# Altium schematic sheet 300_12_DCDC.SchDoc
size A4; SheetNumber: 3; SheetTotal: 7
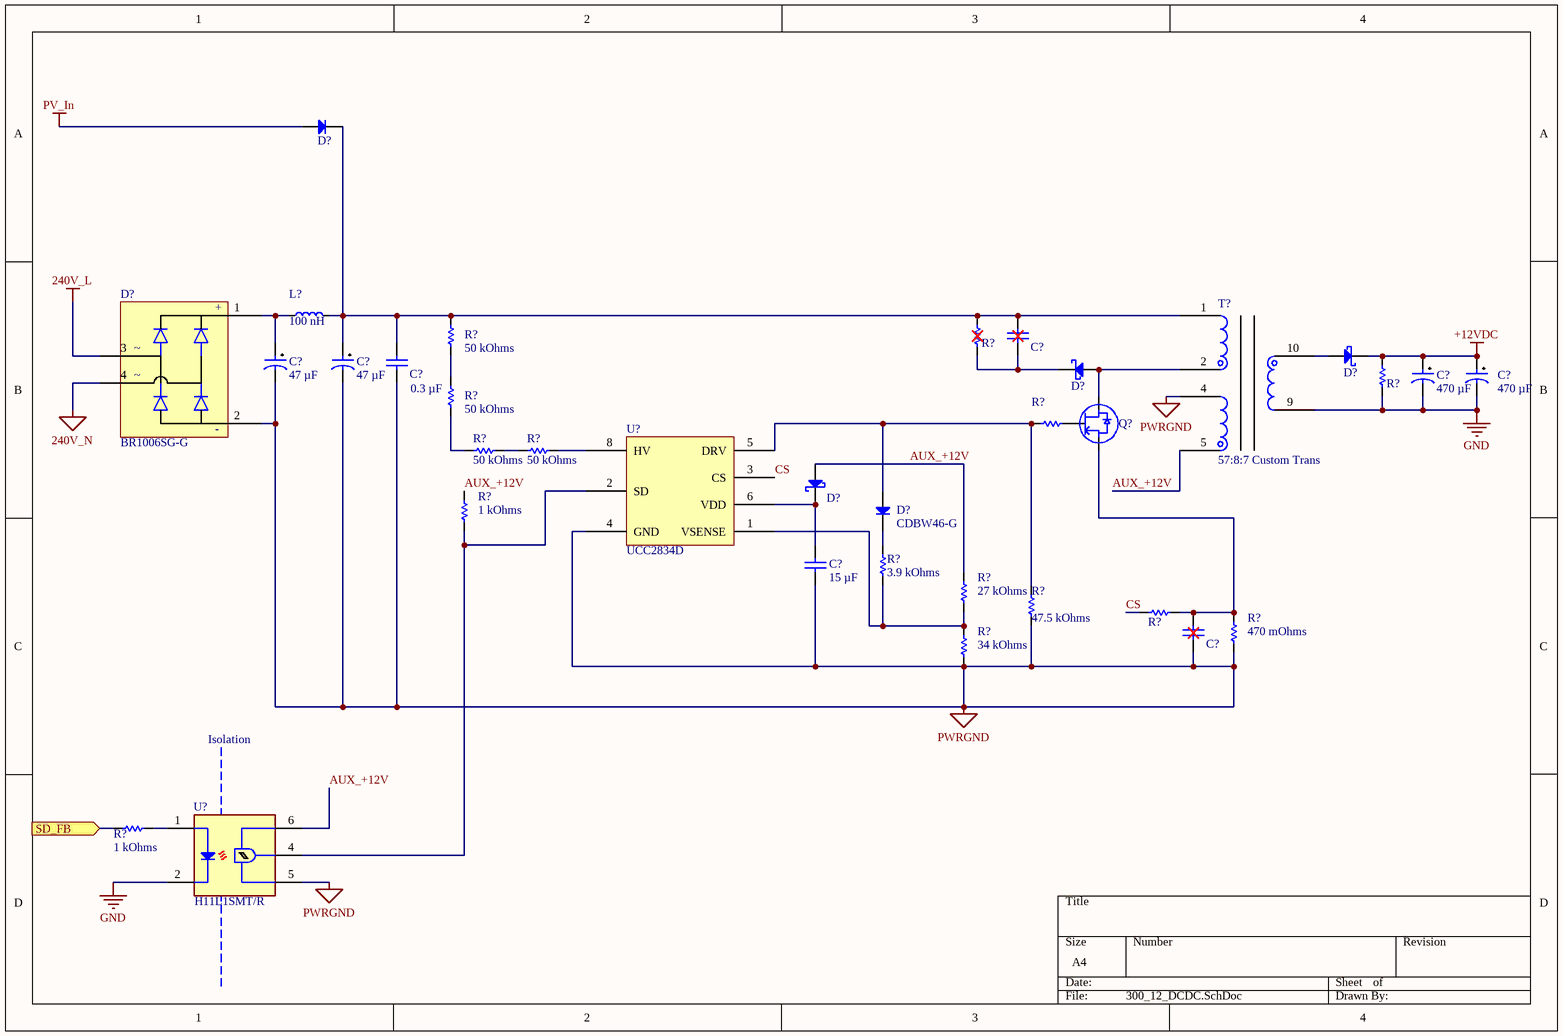
[diagram p0: 300_12_DCDC.SchDoc]

## Parts
(Parts that share a designator on the sheet are numbered #1, #2 ... from top to bottom, then left to right.)
C?#1  .1u  [0402c]  (value not drawn)
C?#2  47 µF  [1206C]
C?#3  47 µF  [1206C]
C?#4  0.3 µF  [ECW-F4304JL]
C?#5  470 µF  [A750MS477M1EAAE015]
C?#6  470 µF  [A750MS477M1EAAE015]
C?#7  15 µF  [0805c]
C?#8  .1u  [0402c]  (value not drawn)
D?#1  S3G-13-F  [SMC DO-214AB]  (value not drawn)
D?#2  STPS20M100SG-TR  [D2PAK]  (value not drawn)
D?#3  BR1006SG-G  [BR1006SG-G]
D?#4  UFS180JE3/TR13  [DO-214BA]  (value not drawn)
D?#5  ST1300ATR  [SMA]  (value not drawn)
D?#6  CDBW46-G  [CDBW46-G]
L?  100 nH  [INDP125125X60N]
Q?  STF13NM60ND  [TO-220FP]  (value not drawn)
R?#1  50 kOhms  [1206R]
R?#2  1 kOhms  [0603R]  (value not drawn)
R?#3  9.53 kOhms  [0402R]  (value not drawn)
R?#4  50 kOhms  [1206R]
R?#5  0  [0603R]  (value not drawn)
R?#6  50 kOhms  [1206R]
R?#7  50 kOhms  [1206R]
R?#8  1 kOhms  [0603R]
R?#9  3.9 kOhms  [0603R]
R?#10  27 kOhms  [1206R]
R?#11  0  [0603R]  (value not drawn)
R?#12  47.5 kOhms  [0402R]
R?#13  470 mOhms  [PAC100004707FA1000]
R?#14  34 kOhms  [CMF5034K000FHEB]
R?#15  1 kOhms  [0603R]
T?  57:8:7 Custom Trans  [E25-13-7]
U?#1  UCC2834D
U?#2  H11L1SMT/R  [H11L1SMT/R]

## Ports
SD_FB (in)

## Nets
240V_L: D?#3.3
240V_N: D?#3.4
+12VDC: C?#5.1 C?#6.1 D?#2.1(K) R?#3.2
GND: C?#5.2 C?#6.2 R?#3.1 T?.9 U?#2.2
PV_In: D?#1.2(A)
PWRGND: C?#2.2 C?#3.2 C?#4.2 C?#7.2 C?#8.2 D?#3.2 R?#12.1 R?#13.1 R?#14.1 T?.4 U?#1.4(GND) U?#2.5
AUX_+12V: D?#5.2(A) R?#8.2 R?#10.2 T?.5 U?#2.6
CS: R?#11.1 U?#1.3(CS)
SD_FB: R?#15.1 ; port SD_FB
NetC?#1_1: C?#1.1 C?#3.1 C?#4.1 D?#1.1(K) L?.2 R?#1.2 R?#2.2 T?.1
NetC?#1_2: C?#1.2 D?#4.1(K) R?#2.1
NetC?#2_1: C?#2.1 D?#3.1 L?.1
NetC?#7_1: C?#7.1 D?#5.1(K) U?#1.6(VDD)
NetC?#8_1: C?#8.1 Q?.3(Source) R?#11.2 R?#13.2
NetD?#2_2: D?#2.2(A) T?.10
NetD?#4_2: D?#4.2(A) Q?.2(Drain) T?.2
NetD?#6_1: D?#6.1(K) R?#9.1
NetD?#6_2: D?#6.2(A) R?#5.1 R?#12.2 U?#1.5(DRV)
NetQ?_1: Q?.1(Gate) R?#5.2
NetR?#1_1: R?#1.1 R?#4.2
NetR?#4_1: R?#4.1 R?#6.2
NetR?#6_1: R?#6.1 R?#7.2
NetR?#7_1: R?#7.1 U?#1.8(HV)
NetR?#8_1: R?#8.1 U?#1.2(SD) U?#2.4
NetR?#9_2: R?#9.2 R?#10.1 R?#14.2 U?#1.1(VSENSE)
NetR?#15_2: R?#15.2 U?#2.1

## Notes on the sheet
- Isolation
- (in symbol BR1006SG-G) +; ~; -

## Library data of the parts
C?#1 C?#8 = 1000-0015: CAP CER 0.1UF 16V X7R 0402; Manufacturer: TDK Corporation; Manufacturer Part Number: C1005X7R1C104K050BC; id: 310046; inventory_price: 0.0202; x_Capacitance: 0.1µF; x_Link_Description: Datasheet; x_max_temp: 125°C; x_min_temp: -55°C; x_Tolerance: ±10%; Value: .1u; partnumber: 1000-0015; created_on: 8/04/2019 9:50:39 AM; parttype: Ceramic Capacitors; rohs: 1; updated_on: 24/08/2021 12:09:53 PM; x_Link_URL: https://product.tdk.com/info/en/catalog/datasheets/mlcc_commercial_general_en.pdf?ref_disty=digikey
C?#2 C?#3 = 1033-0002: CAP ALUM 47UF 20% 400V RADIAL; Manufacturer: Panasonic Electronic Components; Manufacturer Part Number: EEU-EE2G470S; id: 459059; inventory_price: 2.43; x_current: Not Applicable; x_Link_Description: Datasheet; x_max_temp: 105°C; x_min_temp: -25°C; x_portToUnleashed: No; partnumber: 1033-0002; created_on: 21/02/2022 8:54:15 PM; parttype: Aluminum Electrolytic Capacitors; rohs: 1; updated_on: 21/02/2022 8:56:13 PM; x_Capacitance: 47 µF; x_inductance: Not Applicable; x_Link_URL: https://industrial.panasonic.com/ww/products/capacitors/aluminum-capacitors/aluminum-cap-lead/models/EEUEE2G470S; x_Power: Not Applicable; x_resistance: Not Applicable; x_temp_coef: Not Applicable; x_Tolerance: ±20%; x_Vol: 400 V
C?#4 = 1094-0005: CAP FILM 0.3UF 5% 400VDC RADIAL; Manufacturer: Panasonic Electronic Components; id: 459053; inventory_price: 1.75; x_current: Not Applicable; x_Link_Description: Datasheet; x_max_temp: 105°C; x_min_temp: -40°C; x_portToUnleashed: No; Manufacturer Part Number: ECW-F4304JL; partnumber: 1094-0005; created_on: 21/02/2022 8:06:52 PM; parttype: Film Capacitors; rohs: 0; updated_on: 21/02/2022 8:08:01 PM; x_Capacitance: 0.3 µF; x_inductance: Not Applicable; x_Link_URL: https://industrial.panasonic.com/ww/products/pt/film-cap-electroequip/models/ECWF4304JL; x_Power: Not Applicable; x_resistance: Not Applicable; x_temp_coef: Not Applicable; x_Tolerance: ±5%; x_Vol: Not Applicable
C?#5 C?#6 = 1032-0004: CAP ALUM POLY 470UF 20% 25V T/H; Manufacturer: KEMET; id: 458848; inventory_price: 1.01; x_current: Not Applicable; x_Link_Description: Datasheet; x_max_temp: 105°C; x_min_temp: -55°C; x_portToUnleashed: No; Manufacturer Part Number: A750MS477M1EAAE015; partnumber: 1032-0004; created_on: 17/02/2022 8:03:33 PM; parttype: Aluminum - Polymer Capacitors; rohs: 1; updated_on: 18/02/2022 8:18:34 AM; x_Capacitance: 470 µF; x_inductance: Not Applicable; x_Link_URL: https://api.kemet.com/component-edge/download/datasheet/A750MS477M1EAAE015.pdf; x_Power: Not Applicable; x_resistance: Not Applicable; x_temp_coef: Not Applicable; x_Tolerance: ±20%; x_Vol: 25 V
C?#7 = 1000-0133: CAP CER 15UF 35V X5R 0805; Manufacturer: TDK Corporation; Manufacturer Part Number: C2012X5R1V156M125AC; id: 458836; inventory_price: 0.68; x_current: Not Applicable; x_max_temp: 85°C; x_min_temp: -55°C; x_portToUnleashed: No; x_Tolerance: ±20%; partnumber: 1000-0133; created_on: 17/02/2022 3:49:01 PM; parttype: Ceramic Capacitors; rohs: 1; updated_on: 17/02/2022 3:49:19 PM; x_Capacitance: 15 µF; x_inductance: Not Applicable; x_Power: Not Applicable; x_resistance: Not Applicable; x_temp_coef: X5R; x_Vol: 35V
D?#1 = 1047-0014: DIODE GEN PURP 400V 3A SMC; Manufacturer: Diodes Incorporated; Current: A; Voltage: V; id: 459057; inventory_price: 0.4; x_Capacitance: Not Applicable; x_Link_Description: Datasheet; x_portToUnleashed: No; Supplier 1: Digi-Key; Supplier Part Number 1: CUS10S30H3FTR-ND; Manufacturer Part Number: S3G-13-F; Mount: SMT; ComponentLink1URL: https://toshiba.semicon-storage.com/info/docget.jsp?did=14077&prodName=CUS10S30; ComponentLink1Description: Datasheet; partnumber: 1047-0014; created_on: 21/02/2022 8:49:25 PM; parttype: Diodes - Rectifiers - Single; rohs: 1; updated_on: 21/02/2022 8:59:25 PM; x_current: Not Applicable; x_inductance: Not Applicable; x_Link_URL: https://www.diodes.com/assets/Datasheets/ds16005.pdf; x_max_temp: N/A; x_min_temp: N/A; x_Power: Not Applicable; x_resistance: Not Applicable; x_temp_coef: Not Applicable; x_Tolerance: Not Applicable; x_Vol: Not Applicable
D?#2 = 1047-0013: DIODE SCHOTTKY 100V 20A D2PAK; Manufacturer: STMicroelectronics; Current: A; Voltage: V; id: 458846; inventory_price: 2.93; x_Capacitance: Not Applicable; x_Link_Description: Datasheet; x_portToUnleashed: No; Supplier 1: Digi-Key; Supplier Part Number 1: CUS10S30H3FTR-ND; Manufacturer Part Number: STPS20M100SG-TR; Mount: SMT; ComponentLink1URL: https://toshiba.semicon-storage.com/info/docget.jsp?did=14077&prodName=CUS10S30; ComponentLink1Description: Datasheet; partnumber: 1047-0013; created_on: 17/02/2022 7:53:41 PM; parttype: Diodes - Rectifiers - Single; rohs: 1; updated_on: 17/02/2022 8:01:32 PM; x_current: Not Applicable; x_inductance: Not Applicable; x_Link_URL: https://www.st.com/content/ccc/resource/technical/document/datasheet/group2/8f/d3/41/ea/82/b2/4b/5a/CD00228904/files/CD00228904.pdf/jcr:content/translations/en.CD00228904.pdf; x_max_temp: N/A; x_min_temp: N/A; x_Power: Not Applicable; x_resistance: Not Applicable; x_temp_coef: Not Applicable; x_Tolerance: Not Applicable; x_Vol: Not Applicable
D?#3 = BR1006SG-G: BRIDGE RECT 1PHASE 600V 10A BR-8
D?#4 = 1047-0010: DIODE GEN PURP 800V 1A DO214BA; Manufacturer: Microchip Technology; Current: A; Voltage: V; id: 458837; inventory_price: 0.86; x_Capacitance: Not Applicable; x_Link_Description: Datasheet; x_portToUnleashed: No; Supplier 1: Digi-Key; Supplier Part Number 1: CUS10S30H3FTR-ND; Manufacturer Part Number: UFS180JE3/TR13; Mount: SMT; ComponentLink1URL: https://toshiba.semicon-storage.com/info/docget.jsp?did=14077&prodName=CUS10S30; ComponentLink1Description: Datasheet; partnumber: 1047-0010; created_on: 17/02/2022 3:56:14 PM; parttype: Diodes - Rectifiers - Single; rohs: 0; updated_on: 18/02/2022 8:01:42 AM; x_current: Not Applicable; x_inductance: Not Applicable; x_Link_URL: https://media.digikey.com/pdf/Data%20Sheets/Microsemi%20PDFs/UFS160J-UFS180J.pdf; x_max_temp: N/A; x_min_temp: N/A; x_Power: Not Applicable; x_resistance: Not Applicable; x_temp_coef: Not Applicable; x_Tolerance: Not Applicable; x_Vol: Not Applicable
D?#5 = 1047-0011: DIODE SCHOTTKY 300V 1A SMA; Manufacturer: SMC Diode Solutions; Current: A; Voltage: V; id: 458838; inventory_price: 0.12135; x_Capacitance: Not Applicable; x_Link_Description: Datasheet; x_portToUnleashed: No; Supplier 1: Digi-Key; Supplier Part Number 1: CUS10S30H3FTR-ND; Manufacturer Part Number: ST1300ATR; Mount: SMT; ComponentLink1URL: https://toshiba.semicon-storage.com/info/docget.jsp?did=14077&prodName=CUS10S30; ComponentLink1Description: Datasheet; partnumber: 1047-0011; created_on: 17/02/2022 3:57:51 PM; parttype: Diodes - Rectifiers - Single; rohs: 1; updated_on: 17/02/2022 6:22:54 PM; x_current: Not Applicable; x_inductance: Not Applicable; x_Link_URL: https://www.smc-diodes.com/propdf/ST1300A%20N1554%20REV.A.pdf; x_max_temp: N/A; x_min_temp: N/A; x_Power: Not Applicable; x_resistance: Not Applicable; x_temp_coef: Not Applicable; x_Tolerance: Not Applicable; x_Vol: Not Applicable
D?#6 = 1047-0012: DIODE SCHOTTKY 100V 150MA SOD123; Manufacturer: Comchip Technology; Current: A; Voltage: V; id: 458839; inventory_price: 0.34; x_Capacitance: Not Applicable; x_Link_Description: Datasheet; x_portToUnleashed: No; Supplier 1: Digi-Key; Supplier Part Number 1: CUS10S30H3FTR-ND; Manufacturer Part Number: CDBW46-G; Mount: SMT; ComponentLink1URL: https://toshiba.semicon-storage.com/info/docget.jsp?did=14077&prodName=CUS10S30; ComponentLink1Description: Datasheet; partnumber: 1047-0012; created_on: 17/02/2022 6:00:01 PM; parttype: Diodes - Rectifiers - Single; rohs: 1; updated_on: 17/02/2022 6:06:35 PM; x_current: Not Applicable; x_inductance: Not Applicable; x_Link_URL: https://www.comchiptech.com/admin/files/product/QW-BA018%20CDBW46-G%20RevD.pdf; x_max_temp: N/A; x_min_temp: N/A; x_Power: Not Applicable; x_resistance: Not Applicable; x_temp_coef: Not Applicable; x_Tolerance: Not Applicable; x_Vol: Not Applicable
L? = 1002-0028: FIXED IND 100NH 2.85A 24MOHM SMD; Manufacturer Part Number: NLCV32T-R10M-EFR; manufacturer: TDK Corporation; id: 459058; inventory_price: 0.1089; x_Capacitance: Not Applicable; x_max_temp: 105°C; x_min_temp: -40°C; x_portToUnleashed: No; x_Tolerance: ±20%; ComponentLink1Description: Datasheet; ComponentLink1URL: https://www.bourns.com/docs/Product-Datasheets/SRR1260.pdf; partnumber: 1002-0028; created_on: 21/02/2022 8:52:59 PM; parttype: Fixed Inductors; rohs: 1; updated_on: 21/02/2022 8:56:58 PM; x_current: 2.85 A; x_inductance: 100 nH; x_Power: Not Applicable; x_resistance: Not Applicable; x_temp_coef: Not Applicable; x_Vol: Not Applicable
Q? = 1051-0004: MOSFET N-CH 600V 11A TO220FP; Manufacturer: STMicroelectronics; Current: A; Voltage: V; id: 458840; inventory_price: 4.14; x_Capacitance: Not Applicable; x_Link_Description: Datasheet; x_max_temp: (TJ); x_min_temp: 150°C; x_portToUnleashed: No; Supplier 1: Digi-Key; Manufacturer Part Number: STF13NM60ND; Supplier Part Number 1: 568-6720-1-ND; Mount: SMT; ComponentLink1Description: Datasheet; partnumber: 1051-0004; created_on: 17/02/2022 6:43:09 PM; parttype: Transistors - FETs, MOSFETs - Single; rohs: 1; updated_on: 17/02/2022 7:23:29 PM; x_current: Not Applicable; x_inductance: Not Applicable; x_Link_URL: https://media.digikey.com/pdf/Data%20Sheets/ST%20Microelectronics%20PDFS/STx13NM60ND_DS.pdf; x_Power: Not Applicable; x_resistance: Not Applicable; x_temp_coef: Not Applicable; x_Tolerance: Not Applicable; x_Vol: Not Applicable
R?#1 R?#4 R?#6 R?#7 = 1007-0164: RES SMD 50K OHM 0.1% 1/4W 1206; Manufacturer: YAGEO; Manufacturer Part Number: RT1206BRD0750KL; id: 458832; inventory_price: 0.65; x_Capacitance: Not Applicable; x_Link_Description: Datasheet; x_max_temp: 155°C; x_min_temp: -55°C; x_portToUnleashed: No; x_Power: 0.25W, 1/4W; x_temp_coef: ±25ppm/°C; partnumber: 1007-0164; created_on: 17/02/2022 3:33:02 PM; parttype: Chip Resistor - Surface Mount; rohs: 1; updated_on: 17/02/2022 3:33:19 PM; x_current: Not Applicable; x_inductance: Not Applicable; x_Link_URL: https://www.yageo.com/upload/media/product/productsearch/datasheet/rchip/PYu-RT_1-to-0.01_RoHS_L_12.pdf; x_resistance: 50 kOhms; x_Tolerance: ±0.1%; x_Vol: Not Applicable
R?#2 R?#8 R?#15 = 1007-0143: RES 1K OHM 0.1% 1/16W 0603; Manufacturer: Stackpole Electronics Inc; Manufacturer Part Number: RNCS0603BKE1K00; id: 436190; inventory_price: 0.2051; x_Link_Description: Datasheet; x_max_temp: 155°C; x_min_temp: -55°C; partnumber: 1007-0143; created_on: 10/08/2021 1:47:46 PM; parttype: Chip Resistor - Surface Mount; rohs: 1; updated_on: 10/08/2021 1:48:00 PM; x_Link_URL: https://www.seielect.com/catalog/sei-rncs_rnch.pdf; x_Power: 1/16W; x_Tolerance: ±0.1%
R?#3 = 1007-0168: RES SMD 9.53K OHM 1% 1/16W 0402; Manufacturer: Vishay Dale; Manufacturer Part Number: CRCW04029K53FKED; id: 458847; inventory_price: 0.1; x_Capacitance: Not Applicable; x_Link_Description: Datasheet; x_max_temp: 155°C; x_min_temp: -55°C; x_portToUnleashed: No; x_Power: 0.063W, 1/16W; x_temp_coef: ±100ppm/°C; partnumber: 1007-0168; created_on: 17/02/2022 8:00:30 PM; parttype: Chip Resistor - Surface Mount; rohs: 1; updated_on: 17/02/2022 8:00:50 PM; x_current: Not Applicable; x_inductance: Not Applicable; x_Link_URL: https://www.vishay.com/docs/20035/dcrcwe3.pdf; x_resistance: 9.53 kOhms; x_Tolerance: ±1%; x_Vol: Not Applicable
R?#5 R?#11 = rel-res-0016: RES SMD 0 OHM JUMPER 1/10W 0603; Manufacturer: Bourns Inc.; Manufacturer Part Number: CR0603-J/-000ELF; id: 315553; inventory_price: 0.1; x_Capacitance: Not Applicable; x_Link_Description: Datasheet; x_max_temp: 155°C; x_min_temp: -55°C; x_portToUnleashed: No; x_Power: 0.1W, 1/10W; x_resistance: 0 Ohms; Value: 0; partnumber: rel-res-0016; created_on: 28/05/2019 4:44:53 PM; parttype: Chip Resistor - Surface Mount; rohs: 1; updated_on: 11/02/2022 4:52:45 PM; x_current: Not Applicable; x_inductance: Not Applicable; x_Link_URL: https://www.bourns.com/docs/product-datasheets/cr.pdf?sfvrsn=574d41f6_14; x_temp_coef: -; x_Tolerance: Jumper; x_Vol: Not Applicable
R?#9 = 1007-0166: RES 3.9K OHM 1% 1/10W 0603; Manufacturer: YAGEO; Manufacturer Part Number: RC0603FR-073K9L; id: 458835; inventory_price: 0.1; x_Capacitance: Not Applicable; x_Link_Description: Datasheet; x_max_temp: 155°C; x_min_temp: -55°C; x_portToUnleashed: No; x_Power: 0.1W, 1/10W; x_temp_coef: ±100ppm/°C; partnumber: 1007-0166; created_on: 17/02/2022 3:45:28 PM; parttype: Chip Resistor - Surface Mount; rohs: 1; updated_on: 17/02/2022 3:45:46 PM; x_current: Not Applicable; x_inductance: Not Applicable; x_Link_URL: https://www.yageo.com/upload/media/product/productsearch/datasheet/rchip/PYu-RC_Group_51_RoHS_L_11.pdf; x_resistance: 3.9 kOhms; x_Tolerance: ±1%; x_Vol: Not Applicable
R?#10 = 1007-0165: RES 27K OHM 1% 1/4W 1206; Manufacturer: YAGEO; Manufacturer Part Number: RC1206FR-0727KL; id: 458833; inventory_price: 0.1; x_Capacitance: Not Applicable; x_Link_Description: Datasheet; x_max_temp: 155°C; x_min_temp: -55°C; x_portToUnleashed: No; x_Power: 0.25W, 1/4W; x_temp_coef: ±100ppm/°C; partnumber: 1007-0165; created_on: 17/02/2022 3:44:32 PM; parttype: Chip Resistor - Surface Mount; rohs: 1; updated_on: 17/02/2022 3:44:48 PM; x_current: Not Applicable; x_inductance: Not Applicable; x_Link_URL: https://www.yageo.com/upload/media/product/productsearch/datasheet/rchip/PYu-RC_Group_51_RoHS_L_11.pdf; x_resistance: 27 kOhms; x_Tolerance: ±1%; x_Vol: Not Applicable
R?#12 = 1007-0167: RES SMD 47.5K OHM 1% 1/16W 0402; Manufacturer: Vishay Dale; Manufacturer Part Number: CRCW040247K5FKED; id: 458842; inventory_price: 0.1; x_Capacitance: Not Applicable; x_Link_Description: Datasheet; x_max_temp: 155°C; x_min_temp: -55°C; x_portToUnleashed: No; x_Power: 0.063W, 1/16W; x_temp_coef: ±100ppm/°C; partnumber: 1007-0167; created_on: 17/02/2022 7:24:51 PM; parttype: Chip Resistor - Surface Mount; rohs: 1; updated_on: 17/02/2022 7:25:11 PM; x_current: Not Applicable; x_inductance: Not Applicable; x_Link_URL: https://www.vishay.com/docs/20035/dcrcwe3.pdf; x_resistance: 47.5 kOhms; x_Tolerance: ±1%; x_Vol: Not Applicable
R?#13 = 1176-0005: RES 0.47 OHM 1W 1% AXIAL; Manufacturer: Vishay Beyschlag/Draloric/BC Components; id: 458841; inventory_price: 0.78; x_Capacitance: Not Applicable; x_Link_Description: Datasheet; x_max_temp: 275°C; x_min_temp: -55°C; x_portToUnleashed: No; x_temp_coef: ±100ppm/°C; Manufacturer Part Number: PAC100004707FA1000; partnumber: 1176-0005; created_on: 17/02/2022 6:43:36 PM; parttype: Through Hole Resistors; rohs: 1; updated_on: 17/02/2022 6:43:53 PM; x_current: Not Applicable; x_inductance: Not Applicable; x_Link_URL: https://www.vishay.com/docs/28731/pacserie.pdf; x_Power: 1W; x_resistance: 470 mOhms; x_Tolerance: ±1%; x_Vol: Not Applicable
R?#14 = 1176-0004: RES 34.0K OHM 1/4W 1% AXIAL; Manufacturer: Vishay Dale; id: 458834; inventory_price: 0.68; x_Capacitance: Not Applicable; x_Link_Description: Datasheet; x_max_temp: 175°C; x_min_temp: -55°C; x_portToUnleashed: No; x_Power: 0.25W, 1/4W; x_temp_coef: ±50ppm/°C; Manufacturer Part Number: CMF5034K000FHEB; partnumber: 1176-0004; created_on: 17/02/2022 3:45:05 PM; parttype: Through Hole Resistors; rohs: 1; updated_on: 17/02/2022 3:45:23 PM; x_current: Not Applicable; x_inductance: Not Applicable; x_Link_URL: https://www.vishay.com/docs/31018/cmfind.pdf; x_resistance: 34 kOhms; x_Tolerance: ±1%; x_Vol: Not Applicable
T? = Trans: Custom Transformer 57:8:7
U?#1 = UCC2834D: Converter Offline Buck, Flyback Topology 120kHz 7-SOIC
U?#2 = H11L1SMT/R: Logic Output Optoisolator 1MHz Open Collector 5000Vrms 1 Channel - CMTI 6-SM4634D